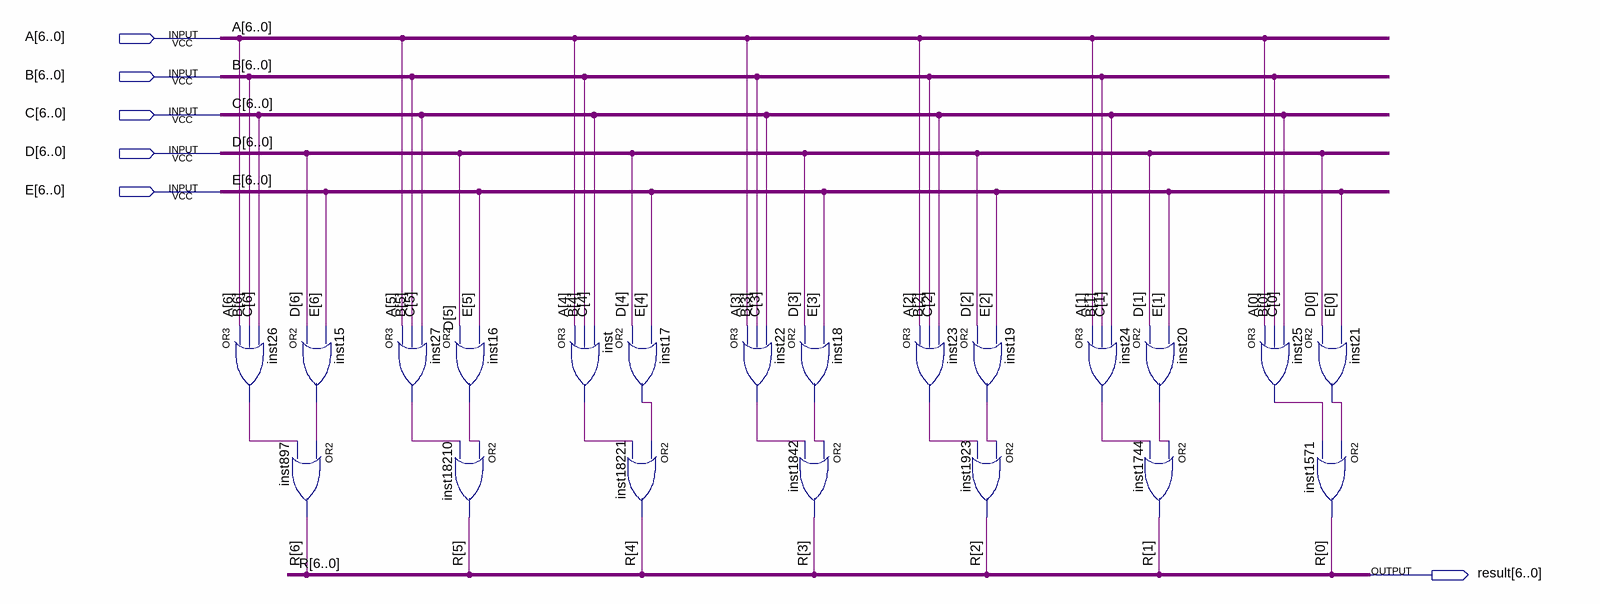
[diagram p0: schematic sheet]
// Quartus schematic Or_Mux.bdf as structural Verilog: 21 symbols, 6 pins
module Or_Mux (
  input  [6:0] A,
  input  [6:0] B,
  input  [6:0] C,
  input  [6:0] D,
  input  [6:0] E,
  output [6:0] result
);

  wire inst15_out, inst16_out, inst17_out, inst18_out, inst19_out, inst20_out, inst21_out, inst22_out,
       inst23_out, inst24_out, inst25_out, inst26_out, inst27_out, inst_out;

  or inst26 (inst26_out, A[6], B[6], C[6]);
  or inst15 (inst15_out, D[6], E[6]);
  or inst897 (result[6], inst15_out, inst26_out);
  or inst27 (inst27_out, A[5], B[5], C[5]);
  or inst16 (inst16_out, D[5], E[5]);
  or inst18210 (result[5], inst16_out, inst27_out);
  or inst (inst_out, A[4], B[4], C[4]);
  or inst17 (inst17_out, D[4], E[4]);
  or inst18221 (result[4], inst17_out, inst_out);
  or inst22 (inst22_out, A[3], B[3], C[3]);
  or inst18 (inst18_out, D[3], E[3]);
  or inst1842 (result[3], inst18_out, inst22_out);
  or inst23 (inst23_out, A[2], B[2], C[2]);
  or inst19 (inst19_out, D[2], E[2]);
  or inst1923 (result[2], inst19_out, inst23_out);
  or inst24 (inst24_out, A[1], B[1], C[1]);
  or inst20 (inst20_out, D[1], E[1]);
  or inst1744 (result[1], inst20_out, inst24_out);
  or inst25 (inst25_out, A[0], B[0], C[0]);
  or inst21 (inst21_out, D[0], E[0]);
  or inst1571 (result[0], inst21_out, inst25_out);

  // Other names for the same wires on the sheet: R[6:0] = result
endmodule
